# Altium project PeripheralBoardV2.PrjPcb
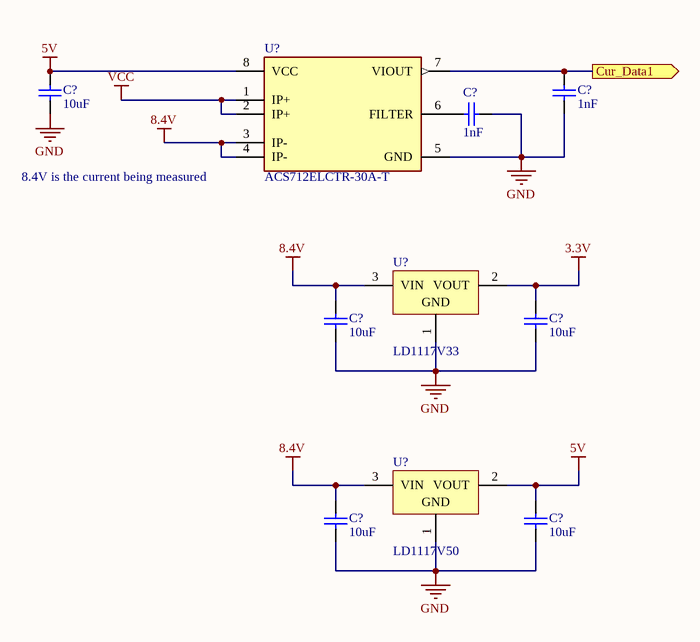
[diagram p0: Power.SchDoc]
2 sheets, 12 parts. Net scope: flat (ports and power ports of the same name join across sheets).
Sheets:
  Power.SchDoc
  Sensing.SchDoc

## Sheet Power.SchDoc
size A; SheetNumber: 1; SheetTotal: 2

### Parts
(Parts that share a designator on the sheet are numbered #1, #2 ... from top to bottom, then left to right.)
C?#1  10uF  [CAPC2013X145X48ML20T23]
C?#2  1nF  [CAPC2013X145X48ML20T23]
C?#3  1nF  [CAPC2013X145X48ML20T23]
C?#4  10uF  [CAPC2013X145X48ML20T23]
C?#5  10uF  [CAPC2013X145X48ML20T23]
C?#6  10uF  [CAPC2013X145X48ML20T23]
C?#7  10uF  [CAPC2013X145X48ML20T23]
U?#1  ACS712ELCTR-30A-T  [FP-LC-8-IPC_C]
U?#2  LD1117V33  [TO220]
U?#3  LD1117V50  [TO220]

### Ports
Cur_Data1 (out)

### Nets
3.3V: C?#5.1 U?#2.2(VOUT)
5V: C?#1.1 C?#7.1 U?#1.8(VCC) U?#3.2(VOUT)
8.4V: C?#4.1 C?#6.1 U?#1.3(IP-) U?#1.4(IP-) U?#2.3(VIN) U?#3.3(VIN)
GND: C?#1.2 C?#2.2 C?#3.2 C?#4.2 C?#5.2 C?#6.2 C?#7.2 U?#1.5(GND) U?#2.1(GND) U?#3.1(GND)
VCC: U?#1.1(IP+) U?#1.2(IP+)
NetC?#2_1: C?#2.1 U?#1.7(VIOUT) ; port Cur_Data1
NetC?#3_1: C?#3.1 U?#1.6(FILTER)

### Notes on the sheet
- (near U?#1) 8.4V is the current being measured

### Library data of the parts
C?#1-C?#7 = CMP-2007-03160-1: Part Number: VJ0805Y103KXBBC31; Manufacturer: Vitramon
U?#1 = CMP-2000-04990-2: SENSOR CURRENT HALL 30A AC/DC; Bandwidth: 80kHz; Max Supply Current: 13mA; Linearity: 1.5%; Operating Supply Voltage: 5V; Quiescent Current: 10mA; Number of Channels: 1; Polarity: Bidirectional; Min Supply Voltage: 4.5V; Response Time: 5us; Sensitivity: 66mV/A; Max Supply Voltage: 5.5V; Current Sensing: 30A; REACH SVHC: No SVHC; Mount: Surface Mount; Max Operating Temperature: 85°C; Packaging: Cut Tape; Frequency: 80kHz; Series: -; Termination: SMD/SMT; RoHS Compliant: Yes; Number of Pins: 8; Package Quantity: 1; Accuracy: 1.5%; Lead Free: Lead Free; Case/Package: SOIC; Min Operating Temperature: -40°C; Output Current: 10mA
U?#2 = CMP-0244-00470-1: Fixed Low Drop Positive Voltage Regulator, 3.3V, 3-Pin TO-220; PackageVersion: ver3.0; PackageDescription: TO, Thru-Hole, Vertical, Heatsink Mounted; 3 In-Line Leads; Pitch 2.54 mm; ComponentLink1Description: Manufacturer URL; ComponentLink3URL: http://www.st.com/internet/com/TECHNICAL_RESOURCES/TECHNICAL_LITERATURE/PACKAGE_INFORMATION/CD00004649.pdf; PackageReference: TO220; ComponentLink2URL: http://www.st.com/internet/com/TECHNICAL_RESOURCES/TECHNICAL_LITERATURE/DATASHEET/CD00000544.pdf; ComponentLink3Description: Package Specification; ComponentLink2Description: Datasheet; ComponentLink1URL: http://www.st.com; DatasheetVersion: 1/11/2011
U?#3 = CMP-0244-00472-1: Fixed Low Drop Positive Voltage Regulator, 5V, 3-Pin TO-220; ComponentLink1URL: http://www.st.com; ComponentLink1Description: Manufacturer URL; DatasheetVersion: 1/11/2011; PackageDescription: TO, Thru-Hole, Vertical, Heatsink Mounted; 3 In-Line Leads; Pitch 2.54 mm; ComponentLink2Description: Datasheet; ComponentLink3URL: http://www.st.com/internet/com/TECHNICAL_RESOURCES/TECHNICAL_LITERATURE/PACKAGE_INFORMATION/CD00004649.pdf; PackageVersion: ver3.0; PackageReference: TO220; ComponentLink2URL: http://www.st.com/internet/com/TECHNICAL_RESOURCES/TECHNICAL_LITERATURE/DATASHEET/CD00000544.pdf; ComponentLink3Description: Package Specification

## Sheet Sensing.SchDoc
size A; SheetNumber: 2; SheetTotal: 2
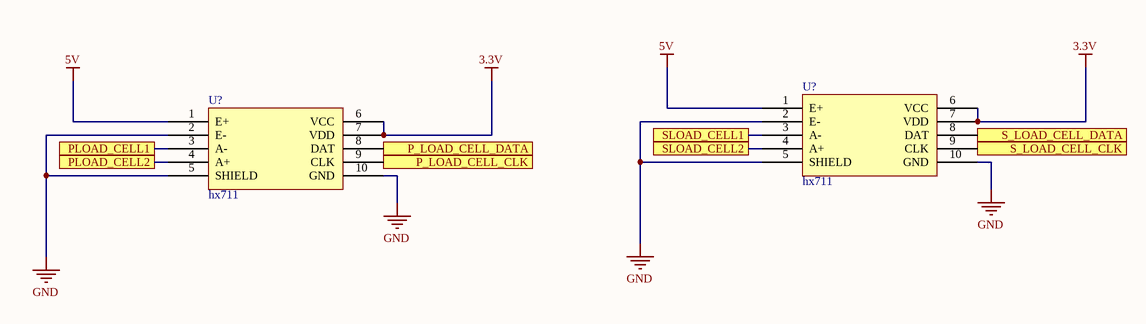
[diagram p1: Sensing.SchDoc]

### Parts
(Parts that share a designator on the sheet are numbered #1, #2 ... from top to bottom, then left to right.)
U?#4  hx711  [PCBComponent_1]
U?#5  hx711  [PCBComponent_1]

### Ports
P_LOAD_CELL_CLK, P_LOAD_CELL_DATA, PLOAD_CELL1, PLOAD_CELL2, S_LOAD_CELL_CLK, S_LOAD_CELL_DATA, SLOAD_CELL1, SLOAD_CELL2

### Nets
3.3V: U?#4.6(VCC) U?#4.7(VDD) U?#5.6(VCC) U?#5.7(VDD)
5V: U?#4.1(E+) U?#5.1(E+)
GND: U?#4.2(E-) U?#4.5(SHIELD) U?#4.10(GND) U?#5.2(E-) U?#5.5(SHIELD) U?#5.10(GND)
NetU?#4_3: U?#4.3(A-) ; port SLOAD_CELL1
NetU?#4_4: U?#4.4(A+) ; port SLOAD_CELL2
NetU?#4_8: U?#4.8(DAT) ; port S_LOAD_CELL_DATA
NetU?#4_9: U?#4.9(CLK) ; port S_LOAD_CELL_CLK
NetU?#5_3: U?#5.3(A-) ; port PLOAD_CELL1
NetU?#5_4: U?#5.4(A+) ; port PLOAD_CELL2
NetU?#5_8: U?#5.8(DAT) ; port P_LOAD_CELL_DATA
NetU?#5_9: U?#5.9(CLK) ; port P_LOAD_CELL_CLK

### Library data of the parts
U?#4 U?#5 = Component_1

## Nets that join several sheets
3.3V: Power (C?#5.1 U?#2.2), Sensing (U?#4.6 U?#4.7 U?#5.6 U?#5.7)
5V: Power (C?#1.1 C?#7.1 U?#1.8 U?#3.2), Sensing (U?#4.1 U?#5.1)
GND: Power (10 pins), Sensing (6 pins)